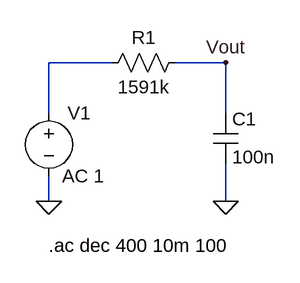
[diagram p0: schematic circuito1.asc]
circuito1.asc, the LTspice schematic file:
Version 4
SHEET 1 880 680
WIRE -32 -32 -112 -32
WIRE 112 -32 48 -32
WIRE -112 32 -112 -32
WIRE 112 32 112 -32
WIRE -112 144 -112 112
WIRE 112 144 112 96
FLAG -112 144 0
FLAG 112 144 0
FLAG 112 -32 Vout
SYMBOL voltage -112 16 R0
WINDOW 123 17 96 Left 2
WINDOW 39 0 0 Left 0
SYMATTR InstName V1
SYMATTR Value ""
SYMATTR Value2 AC 1
SYMBOL res -48 -16 R270
WINDOW 0 32 56 VTop 2
WINDOW 3 0 56 VBottom 2
SYMATTR InstName R1
SYMATTR Value 1591k
SYMBOL cap 96 32 R0
SYMATTR InstName C1
SYMATTR Value 100n
TEXT -112 200 Left 2 !.ac dec 400 10m 100

The netlist it stands for:
* circuito1.asc
V1 N001 0 AC 1
R1 N001 Vout 1591k
C1 Vout 0 100n
.ac dec 400 10m 100
.backanno
.end